# Altium schematic sheet Powerboard in ROV V1.0.SchDoc
size A4; Author: DBY; Version: V1.0
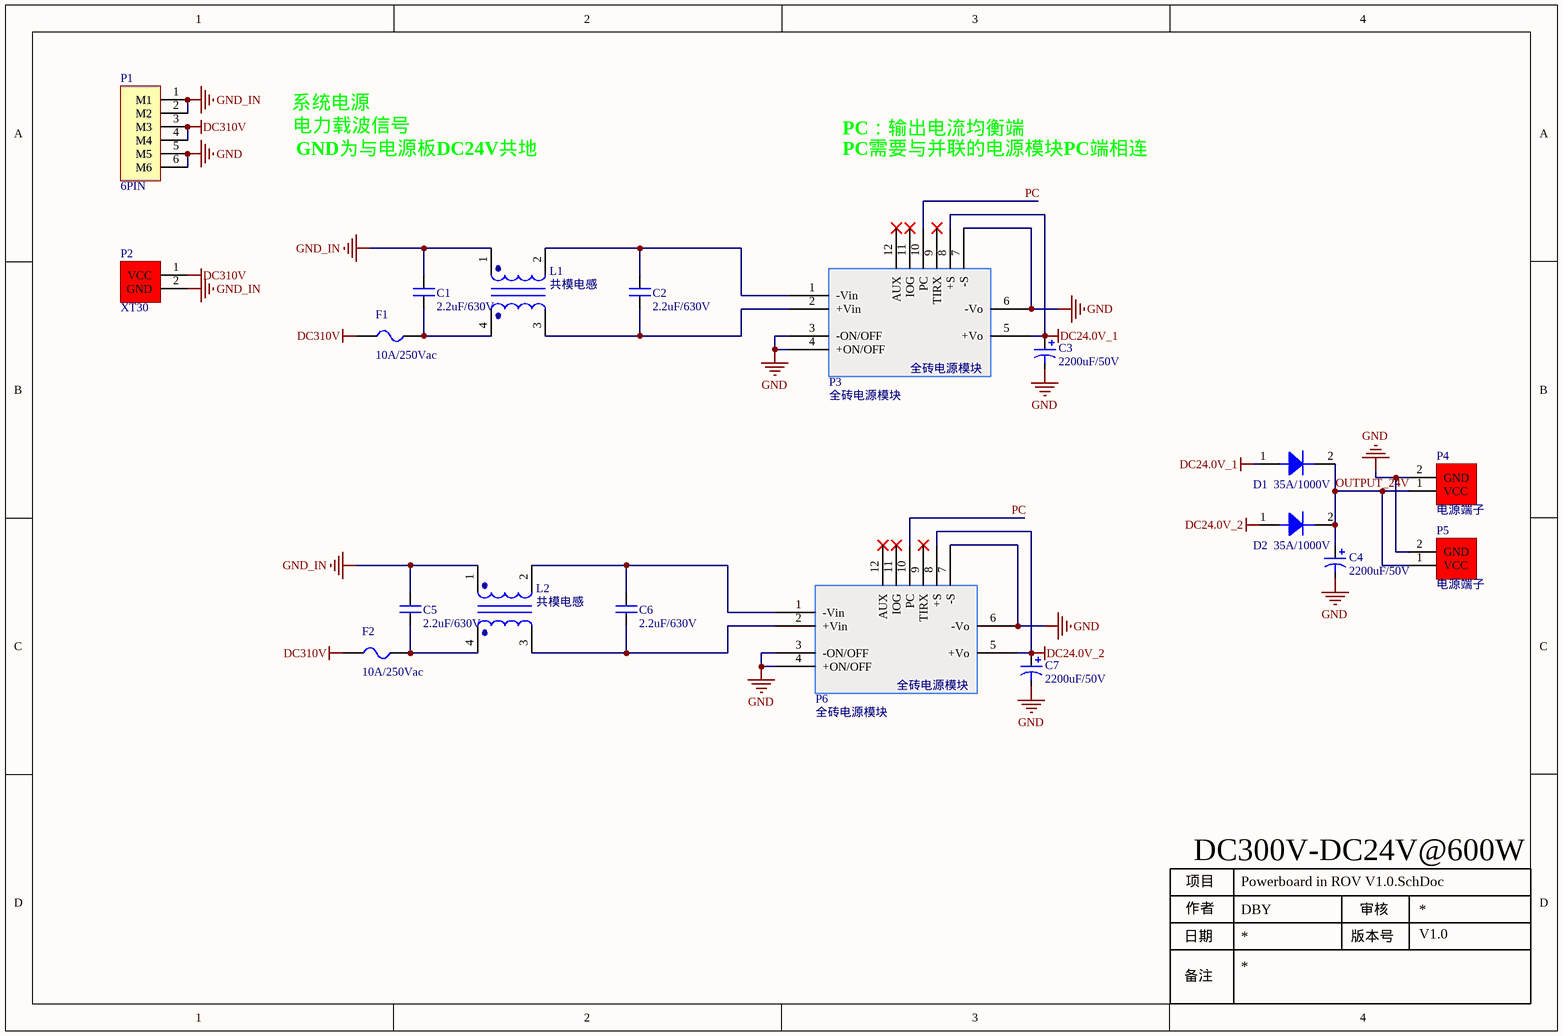
[diagram p0: Powerboard in ROV V1.0.SchDoc]

## Parts
C1  2.2uF/630V  [CCB 电容(27mm)]
C2  2.2uF/630V  [CCB 电容(27mm)]
C3  2200uF/50V  [CAP 7.5*16*31.5-H - GD]
C4  2200uF/50V  [CAP 7.5*16*31.5-H - GD]
C5  2.2uF/630V  [CCB 电容(27mm)]
C6  2.2uF/630V  [CCB 电容(27mm)]
C7  2200uF/50V  [CAP 7.5*16*31.5-H - GD]
D1  35A/1000V  [R-6]
D2  35A/1000V  [R-6]
F1  10A/250Vac  [FU 5x20]
F2  10A/250Vac  [FU 5x20]
L1  共模电感  [UU10.5]
L2  共模电感  [UU10.5]
P1  6PIN  [PH2.0WS-6P]
P2  XT30  [XT30PW-F]
P3  全砖电源模块  [全砖电源模块]
P4  电源端子  [XT60PW-F]
P5  电源端子  [XT60PW-F]
P6  全砖电源模块  [全砖电源模块]

## Nets
DC24.0V_1: C3.1 D1.1 P3.5(+Vo) P3.8(+S)
DC24.0V_2: C7.1 D2.1 P6.5(+Vo) P6.8(+S)
DC310V: F1.1 F2.1 P1.3(M3) P1.4(M4) P2.1(VCC)
GND: C3.2 C4.2 C7.2 P1.5(M5) P1.6(M6) P3.3(-ON/OFF) P3.4(+ON/OFF) P3.6(-Vo) P3.7(-S) P4.2(GND) P5.2(GND) P6.3(-ON/OFF) P6.4(+ON/OFF) P6.6(-Vo) P6.7(-S)
GND_IN: C1.1 C5.1 L1.1 L2.1 P1.1(M1) P1.2(M2) P2.2(GND)
OUTPUT_24V: C4.1 D1.2 D2.2 P4.1(VCC) P5.1(VCC)
PC: P3.10(PC) P6.10(PC)
NetC1_2: C1.2 F1.2 L1.4
NetC2_1: C2.1 L1.3 P3.2(+Vin)
NetC2_2: C2.2 L1.2 P3.1(-Vin)
NetC5_2: C5.2 F2.2 L2.4
NetC6_1: C6.1 L2.3 P6.2(+Vin)
NetC6_2: C6.2 L2.2 P6.1(-Vin)

Not connected (* = marked no-connect by the designer): P3 9(TIRX)* 11(IOG)* 12(AUX)*; P6 9(TIRX)* 11(IOG)* 12(AUX)*

## Notes on the sheet
- 系统电源
- 电力载波信号
- GND为与电源板DC24V共地
- PC需要与并联的电源模块PC端相连
- PC：输出电流均衡端
- DC300V-DC24V@600W
- 项目
- 作者
- 审核
- 日期
- 备注
- 版本号

## Library data of the parts
C1 C2 C5 C6 = Cap2: 无极性CCB电容
C3 C4 C7 = Cap3: 直插极性电容
D1 D2 = Diode: 二极管
F1 F2 = Fuse: 保险丝
P1 = 接线端子-6PIN
P2 = 电源端子
P3 P6 = 全砖电源模块（迪龙）